# EAGLE design 0456_pdm_mic (EAGLE 9.6.2)
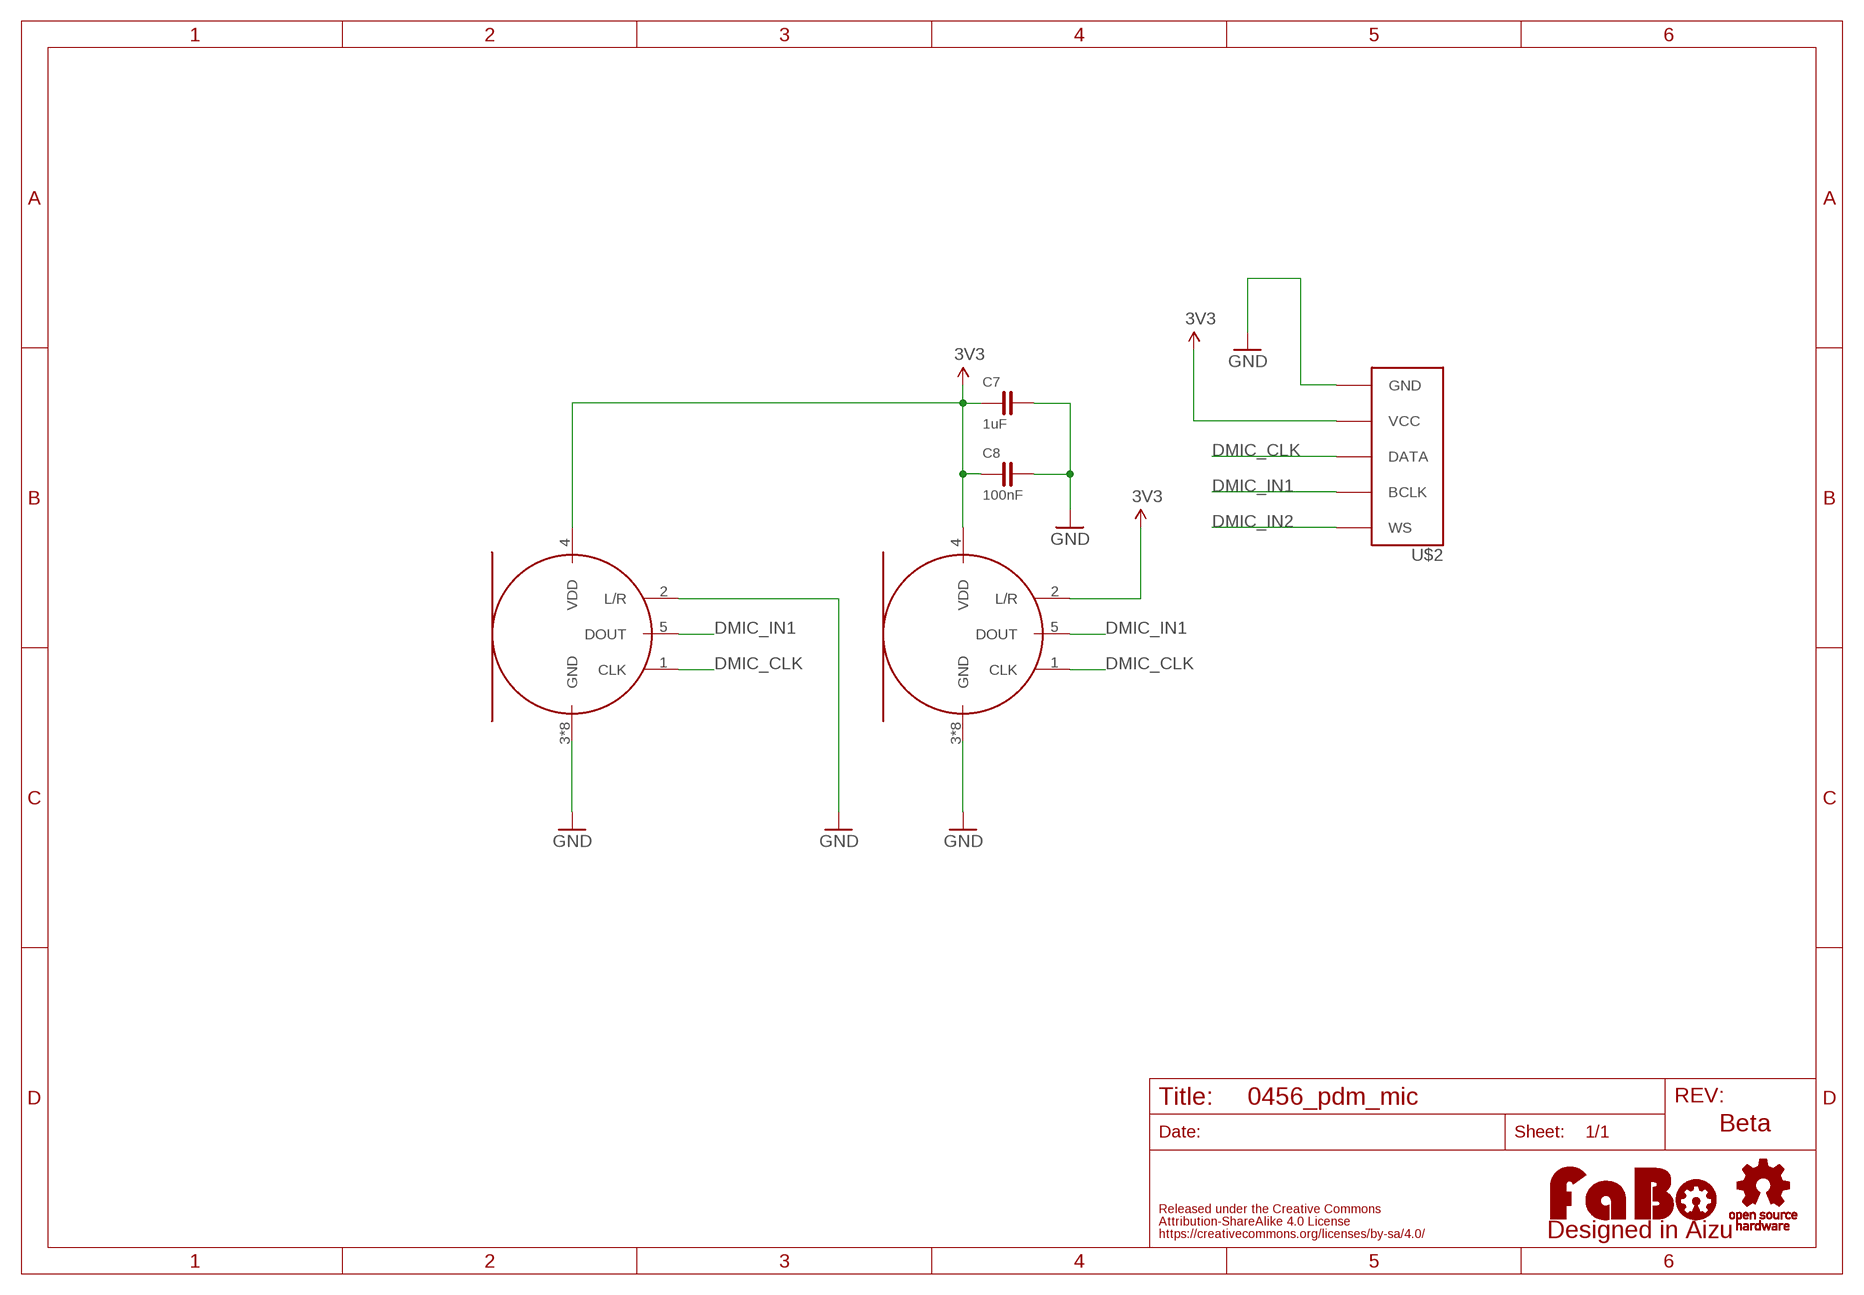
[diagram p0: schematic, sheet 1]

## Parts
C7  1uF  CAPACITOR-0603  [0603]
C8  100nF  CAPACITOR-0603  [0603]
LEFT  PDM_MIC-INMP621  [INMP621]
LOGO1  LOGO_FABO-M  [LOGO_FABO_M]
RIGHT  PDM_MIC-INMP621  [INMP621]
U$2  FABO_BRICK_I2SLONG_BOTTOM  [FABO_BRICK_I2S_S05B-PASK-2_LONG_BOTTOM]
U$3  LOGO_OSHW-M_BOTTOM  [LOGO_OSHW_M_BOTTOM]

## Nets
3V3: C7.1 C8.1 LEFT.4(VDD) RIGHT.2(L/R) RIGHT.4(VDD) U$2.VCC
DMIC_CLK: LEFT.1(CLK) RIGHT.1(CLK) U$2.DATA
DMIC_IN1: LEFT.5(DOUT) RIGHT.5(DOUT) U$2.BCLK
DMIC_IN2: U$2.WS
GND: C7.2 C8.2 LEFT.2(L/R) LEFT.3(GND) LEFT.6(GND) LEFT.7(GND) LEFT.8(GND) LEFT.9(GND) LEFT.10(GND) LEFT.11(GND) LEFT.12(GND) RIGHT.3(GND) RIGHT.6(GND) RIGHT.7(GND) RIGHT.8(GND) RIGHT.9(GND) RIGHT.10(GND) RIGHT.11(GND) RIGHT.12(GND) U$2.GND

## Notes on the sheet
- Beta

## Library data of the parts
C7 C8 = FaBo-Capacitor:CAPACITOR: CAPACITOR
LEFT RIGHT = FaBo-Sound:PDM_MIC
LOGO1 = component:LOGO_FABO
U$2 = FaBo-Template:FABO_BRICK_I2S
U$3 = component:LOGO_OSHW

## Board
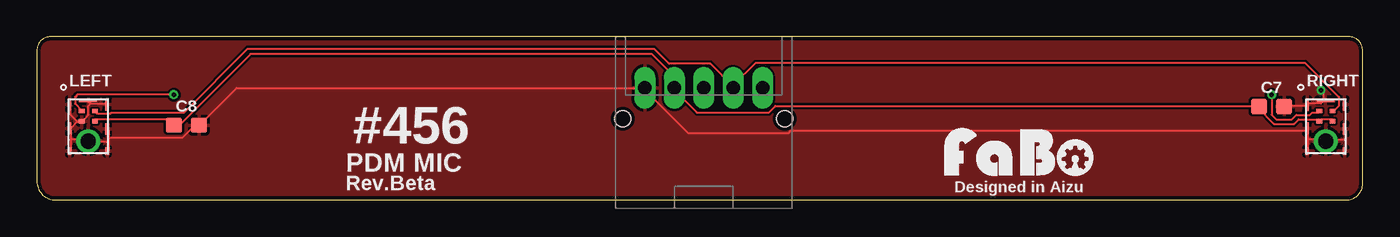
[diagram p1: board, top side]
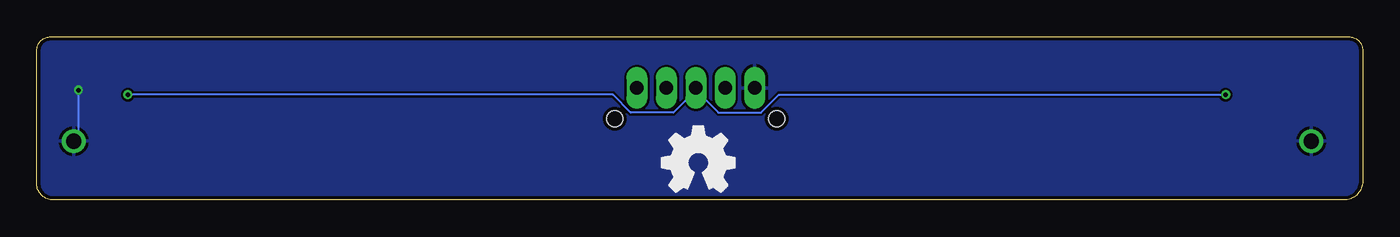
[diagram p2: board, bottom side, seen from below]

Size 90 x 11.1 mm. Coordinates in mm from the lower left corner, seen from the top.
Outline: 90,1.1 90,10.16 arc90 89.06,11.1 0.94,11.1 arc90 0,10.16 0,1.27 arc90 1.27,0 88.9,0 arc90 90,1.1
Copper layers (1*16): Top 0.035mm / dielectric 1.6mm / Bottom 0.035mm
Design rules "PCBway": minimum track width 6mil, minimum drill 12mil, track to track 6mil, track to pad 6mil, pad to pad 6mil, via to via 6mil, smd to smd 6mil, copper to edge 10mil, drill to drill 10mil, minimum pad ring 10mil, minimum via ring 6mil, stop-mask expansion 2mil, vias tented up to drill 100mil, thermal gap 8mil

### Footprints (pad centres in the part's own frame; a part is rotated, then mirrored left to right if it is on the bottom)
0603 = smd 1.1 x 1: 1 -0.85,0; 2 0.85,0
INMP621 = smd 0.398 x 0.298: 1 -0.45,1.05; 2 -0.45,0.35; 4 0.45,0.35; 5 0.45,1.05 | drill 1.024 pad 1.624: 3 0,-1 | smd 0.248 x 0.498: 6 1.275,-1.675; 12 -1.275,-1.675 | smd 0.248 x 0.762: 7 1.275,-0.175; 11 -1.275,-0.125 | smd 0.248 x 0.821: 8 1.265,1.501; 10 -1.275,1.501 | smd 1.168 x 0.248: 9 -0.025,1.775
FABO_BRICK_I2S_S05B-PASK-2_LONG_BOTTOM = drill 0.9 pad 1.422 long: BCLK -2.27,-3.81; DATA -0.27,-3.81; GND 3.73,-3.81; VCC 1.73,-3.81; WS -4.27,-3.81 | hole 1.1: 5.23,-1.71; -5.77,-1.71

### Placement (x,y rotation side)
C7  83.82,6.35 0 top
C8  10.16,5.08 0 top
LEFT  3.5,5 0 top
LOGO1  66.67,1.27 0 top
RIGHT  87.5,5 0 top
U$2  45,3.81 180 top
U$3  45.09,2.54 0 top

### Tracks (layer width: path | path; a pad name or v marks a point on that pad's centre or on a via)
3V3
  Top 0.152: RIGHT.4 87.94,5.49 87.17,5.49 RIGHT.2 87.02,5.49 85.65,5.49 85.34,5.18 83.97,5.18 82.91,6.25 C7.1 82.91,6.4 50.14,6.4 49.68,5.94 44.81,5.94 43.13,7.62 | LEFT.4 3.96,5.49 8.99,5.49 9.3,5.18 C8.1 9.45,5.18 9.75,5.18 14.5,9.93 41.76,9.93 43.13,8.56 43.13,7.62 | 43.13,7.62 U$2.VCC
DMIC_CLK  (via drill 0.3)
  Top 0.152: v9.3,7.16 2.74,7.16 2.59,7.01 2.59,6.55 3.05,6.1 LEFT.1 | v83.82,7.16 83.82,5.79 84.12,5.49 85.19,5.49 85.5,5.79 86.41,5.79 86.56,5.94 87.02,5.94 RIGHT.1
  Bottom 0.152: v9.3,7.16 39.62,7.16 40.84,5.94 43.74,5.94 45.26,7.47 | 45.26,7.47 45.41,7.62 U$2.DATA 45.26,7.47 | v83.82,7.16 50.9,7.16 49.68,5.94 46.79,5.94 45.26,7.47
DMIC_IN1
  Top 0.152: RIGHT.5 88.09,6.1 88.39,6.4 88.39,7.01 86.11,9.3 48.77,9.3 47.27,7.8 U$2.BCLK 47.27,7.72 45.72,9.27 42.93,9.27 41.91,10.29 14.33,10.29 9.96,5.92 5.04,5.92 4.98,5.86 4.14,5.86 LEFT.5
GND  (via drill 0.3)
  Top 0.152: C7.2 84.73,6.4 86.11,6.4 RIGHT.10 86.26,6.55 87.17,6.55 87.33,6.71 RIGHT.9 87.33,6.86 87.33,7.32 v87.17,7.47 | 88.85,4.12 88.85,4.72 RIGHT.7 88.85,4.88 88.85,6.4 RIGHT.8 | 88.85,4.12 88.85,3.35 RIGHT.6 | 86.26,4.12 86.26,4.72 RIGHT.11 86.11,4.72 51.21,4.72 51.05,4.57 44.2,4.57 41.15,7.62 | 86.26,4.12 86.26,3.35 RIGHT.12 | 86.26,4.12 87.48,4.12 RIGHT.3 87.63,4.12 88.85,4.12 | 3.66,6.55 4.72,6.55 LEFT.8 | 3.66,6.55 3.5,6.71 LEFT.9 | 2.74,5.33 3.05,5.33 LEFT.2 3.2,5.49 3.5,5.79 3.5,6.4 3.66,6.55 | 2.74,5.33 2.29,4.88 LEFT.11 2.29,4.72 2.29,4.12 | 2.29,4.12 2.29,3.35 LEFT.12 | 2.74,5.33 2.29,5.79 2.29,6.4 LEFT.10 | 2.29,4.12 3.35,4.12 LEFT.3 3.5,3.96 4.88,3.96 | 4.88,4.27 4.88,4.72 LEFT.7 | 4.88,4.27 4.88,3.96 | 4.88,3.96 4.88,3.35 LEFT.6 | 4.88,4.27 9.91,4.27 10.67,5.03 10.97,5.03 C8.2 11.12,5.18 13.56,7.62 41.15,7.62 | 41.15,7.62 U$2.GND 41.15,7.62
  Bottom 0.152: v87.17,7.47 87.17,4.42 87.48,4.12 RIGHT.3
  pour Top: 0,-0.1 0,11 90.6,11 90.6,0 0.3,0 0.3,-0.3
  pour Bottom: 0.3,0.2 90.6,0.2 90.6,11 0,11 0,-0.3

### Text on the board
tPlace: #456 | PDM MIC | Rev.Beta | Designed in Aizu